# Altium schematic sheet High_Current_Sense.SchDoc
size A; SheetNumber: 12; SheetTotal: 16
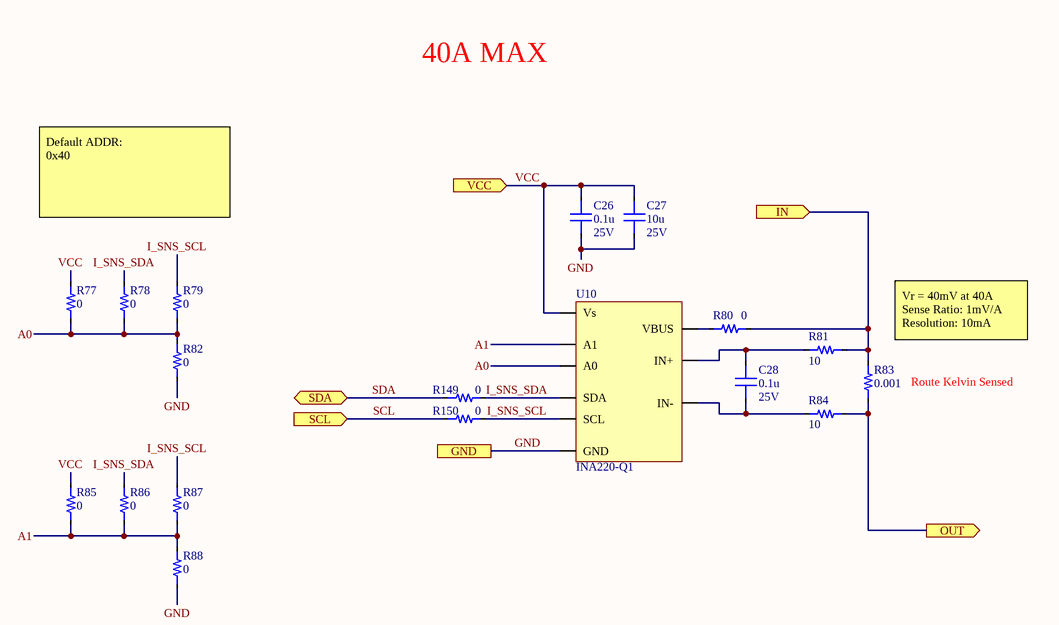
[diagram p0: High_Current_Sense.SchDoc]

## Parts
C26  value 0.1u  Voltage: 25V  [0603_CAP]  (hidden comment: Capacitor)
C27  value 10u  Voltage: 25V  [0805_CAP]  (hidden comment: Capacitor)
C28  value 0.1u  Voltage: 25V  [0603_CAP]  (hidden comment: Capacitor)
R77  value 0  [0603_RES]  (hidden comment: Resistor)
R78  value 0  [0603_RES]  (hidden comment: Resistor)
R79  value 0  [0603_RES]  (hidden comment: Resistor)
R80  value 0  [0603_RES]  (hidden comment: Resistor)
R81  value 10  [0603_RES]  (hidden comment: Resistor)
R82  value 0  [0603_RES]  (hidden comment: Resistor)
R83  value 0.001  [2512_RES]  (hidden comment: Resistor)
R84  value 10  [0603_RES]  (hidden comment: Resistor)
R85  value 0  [0603_RES]  (hidden comment: Resistor)
R86  value 0  [0603_RES]  (hidden comment: Resistor)
R87  value 0  [0603_RES]  (hidden comment: Resistor)
R88  value 0  [0603_RES]  (hidden comment: Resistor)
R149  value 0  [0603_RES]  (hidden comment: Resistor)
R150  value 0  [0603_RES]  (hidden comment: Resistor)
U10  INA220-Q1  [TSSOP-10]

## Ports
GND, IN (in), OUT (out), SCL (in), SDA (bidir), VCC (in)

## Nets
A0: R77.1 R78.1 R79.1 R82.2 U10.2(A0)
A1: R85.1 R86.1 R87.1 R88.2 U10.1(A1)
GND: C26.1 C27.1 R82.1 R88.1 U10.7(GND) ; port GND
I_SNS_SCL: R79.2 R87.2 R150.2 U10.5(SCL)
I_SNS_SDA: R78.2 R86.2 R149.2 U10.4(SDA)
IN: R80.2 R81.2 R83.2 ; port IN
OUT: R83.1 R84.2 ; port OUT
SCL: R150.1 ; port SCL
SDA: R149.1 ; port SDA
VCC: C26.2 C27.2 R77.2 R85.2 U10.6(Vs) ; port VCC
NetC28_1: C28.1 R84.1 U10.9(IN-)
NetC28_2: C28.2 R81.1 U10.10(IN+)
NetR80_1: R80.1 U10.8(VBUS)

## Notes on the sheet
- 40A MAX
- Default ADDR:
  0x40
- Vr = 40mV at 40A
  Sense Ratio: 1mV/A
  Resolution: 10mA
- (near R83) Route Kelvin Sensed

## Library data of the parts
R83 = Resistor: Tolerance: 1%; Power: 2
U10 = INA220-Q1: Current Monitor Regulator High/Low-Side 10mA 10-VSSOP; Name: INA220-Q1; ComponentLink1Description: Datasheet; ComponentLink1URL: https://www.analog.com/media/en/technical-documentation/data-sheets/6100fd.pdf; ComponentLink2Description: Digikey; ComponentLink2URL: https://www.digikey.com/product-detail/en/linear-technology-analog-devices/LT6100CMS8-TRPBF/LT6100CMS8-TRPBFCT-ND/7917234
C26-C28 = Capacitor: Dielectric: *; Percent Tolerance: *; ESR: *
R77-R82 R84-R88 R149 R150 = Resistor: Tolerance: *